# Altium schematic sheet PHOTODIODE.SchDoc
size 420 x 297 mm; SheetNumber: 5; SheetTotal: 5
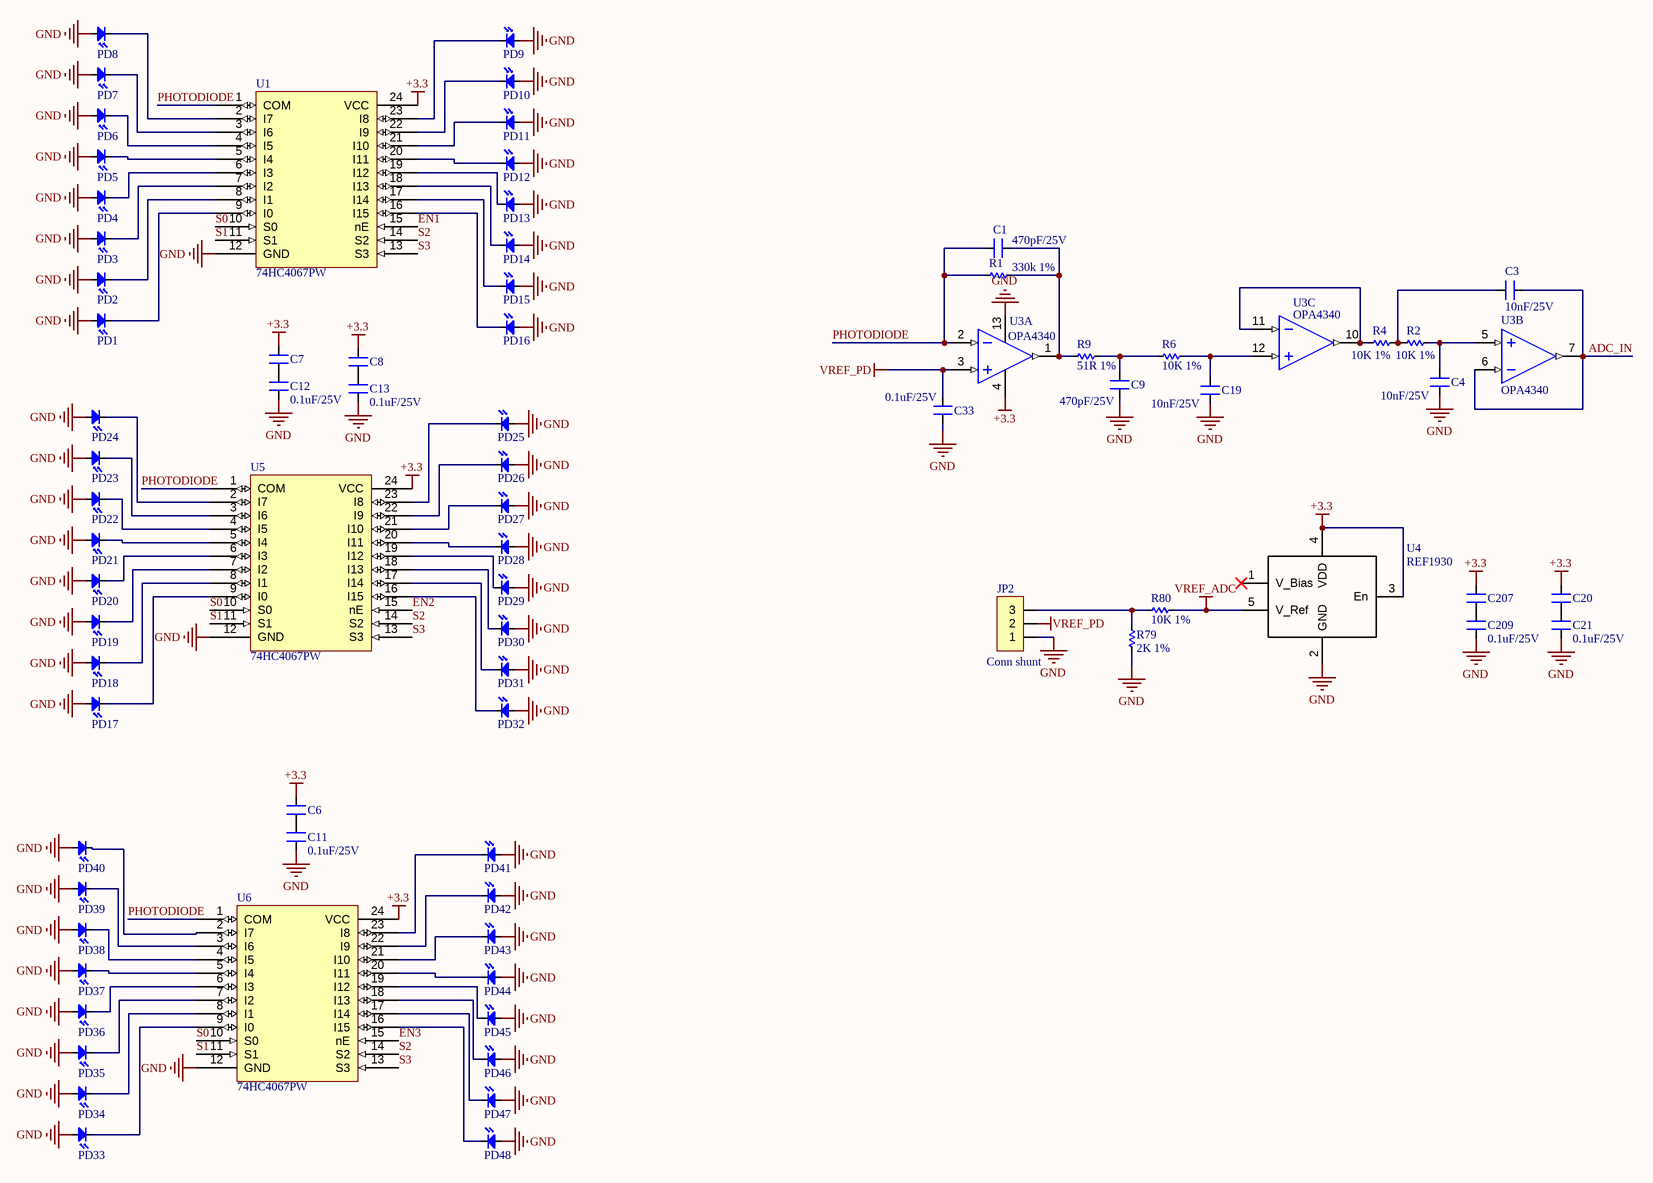
[diagram p0: PHOTODIODE.SchDoc]

## Parts
C1  470pF/25V  [SM-0603]
C3  10nF/25V  [SM-0603]
C4  10nF/25V  [SM-0603]
C6  0.1uF/25V  [SM-0603]  (value not drawn)
C7  0.1uF/25V  [SM-0603]  (value not drawn)
C8  0.1uF/25V  [SM-0603]  (value not drawn)
C9  470pF/25V  [SM-0603]
C11  0.1uF/25V  [SM-0603]
C12  0.1uF/25V  [SM-0603]
C13  0.1uF/25V  [SM-0603]
C19  10nF/25V  [SM-0603]
C20  0.1uF/25V  [SM-0603]  (value not drawn)
C21  0.1uF/25V  [SM-0603]
C33  0.1uF/25V  [SM-0603]
C207  0.1uF/25V  [SM-0603]  (value not drawn)
C209  0.1uF/25V  [SM-0603]
JP2  Conn shunt  [M50-3930342]
PD1  Photodiode  [VEMD5080X01]  (value not drawn)
PD2  Photodiode  [VEMD5080X01]  (value not drawn)
PD3  Photodiode  [VEMD5080X01]  (value not drawn)
PD4  Photodiode  [VEMD5080X01]  (value not drawn)
PD5  Photodiode  [VEMD5080X01]  (value not drawn)
PD6  Photodiode  [VEMD5080X01]  (value not drawn)
PD7  Photodiode  [VEMD5080X01]  (value not drawn)
PD8  Photodiode  [VEMD5080X01]  (value not drawn)
PD9  Photodiode  [VEMD5080X01]  (value not drawn)
PD10  Photodiode  [VEMD5080X01]  (value not drawn)
PD11  Photodiode  [VEMD5080X01]  (value not drawn)
PD12  Photodiode  [VEMD5080X01]  (value not drawn)
PD13  Photodiode  [VEMD5080X01]  (value not drawn)
PD14  Photodiode  [VEMD5080X01]  (value not drawn)
PD15  Photodiode  [VEMD5080X01]  (value not drawn)
PD16  Photodiode  [VEMD5080X01]  (value not drawn)
PD17  Photodiode  [VEMD5080X01]  (value not drawn)
PD18  Photodiode  [VEMD5080X01]  (value not drawn)
PD19  Photodiode  [VEMD5080X01]  (value not drawn)
PD20  Photodiode  [VEMD5080X01]  (value not drawn)
PD21  Photodiode  [VEMD5080X01]  (value not drawn)
PD22  Photodiode  [VEMD5080X01]  (value not drawn)
PD23  Photodiode  [VEMD5080X01]  (value not drawn)
PD24  Photodiode  [VEMD5080X01]  (value not drawn)
PD25  Photodiode  [VEMD5080X01]  (value not drawn)
PD26  Photodiode  [VEMD5080X01]  (value not drawn)
PD27  Photodiode  [VEMD5080X01]  (value not drawn)
PD28  Photodiode  [VEMD5080X01]  (value not drawn)
PD29  Photodiode  [VEMD5080X01]  (value not drawn)
PD30  Photodiode  [VEMD5080X01]  (value not drawn)
PD31  Photodiode  [VEMD5080X01]  (value not drawn)
PD32  Photodiode  [VEMD5080X01]  (value not drawn)
PD33  Photodiode  [VEMD5080X01]  (value not drawn)
PD34  Photodiode  [VEMD5080X01]  (value not drawn)
PD35  Photodiode  [VEMD5080X01]  (value not drawn)
PD36  Photodiode  [VEMD5080X01]  (value not drawn)
PD37  Photodiode  [VEMD5080X01]  (value not drawn)
PD38  Photodiode  [VEMD5080X01]  (value not drawn)
PD39  Photodiode  [VEMD5080X01]  (value not drawn)
PD40  Photodiode  [VEMD5080X01]  (value not drawn)
PD41  Photodiode  [VEMD5080X01]  (value not drawn)
PD42  Photodiode  [VEMD5080X01]  (value not drawn)
PD43  Photodiode  [VEMD5080X01]  (value not drawn)
PD44  Photodiode  [VEMD5080X01]  (value not drawn)
PD45  Photodiode  [VEMD5080X01]  (value not drawn)
PD46  Photodiode  [VEMD5080X01]  (value not drawn)
PD47  Photodiode  [VEMD5080X01]  (value not drawn)
PD48  Photodiode  [VEMD5080X01]  (value not drawn)
R1  330k 1%  [RES-SMD-0603]
R2  10K 1%  [RES-SMD-0603]
R4  10K 1%  [RES-SMD-0603]
R6  10K 1%  [RES-SMD-0603]
R9  51R 1%  [RES-SMD-0603]
R79  2K 1%  [RES-SMD-0603]
R80  10K 1%  [RES-SMD-0603]
U1  74HC4067PW  [TSSOP24]
U3  OPA4340  [SSOP16]  (parts A,B,C of 4)
U4  REF1930  [SOT23-5]
U5  74HC4067PW  [TSSOP24]
U6  74HC4067PW  [TSSOP24]

## Nets
+3.3: C6.2 C7.2 C8.2 C20.2 C207.2 U1.24(VCC) U3.4(+V) U4.3(En) U4.4(VDD) U5.24(VCC) U6.24(VCC)
GND: C4.1 C9.1 C11.1 C12.1 C13.1 C19.1 C21.1 C33.1 C209.1 JP2.1 PD1.1(A) PD2.1(A) PD3.1(A) PD4.1(A) PD5.1(A) PD6.1(A) PD7.1(A) PD8.1(A) PD9.1(A) PD10.1(A) PD11.1(A) PD12.1(A) PD13.1(A) PD14.1(A) PD15.1(A) PD16.1(A) PD17.1(A) PD18.1(A) PD19.1(A) PD20.1(A) PD21.1(A) PD22.1(A) PD23.1(A) PD24.1(A) PD25.1(A) PD26.1(A) PD27.1(A) PD28.1(A) PD29.1(A) PD30.1(A) PD31.1(A) PD32.1(A) PD33.1(A) PD34.1(A) PD35.1(A) PD36.1(A) PD37.1(A) PD38.1(A) PD39.1(A) PD40.1(A) PD41.1(A) PD42.1(A) PD43.1(A) PD44.1(A) PD45.1(A) PD46.1(A) PD47.1(A) PD48.1(A) R79.1 U1.12(GND) U3.13(-V) U4.2(GND) U5.12(GND) U6.12(GND)
VREF_ADC: R80.1 U4.5(V_Ref)
VREF_PD: C33.2 JP2.2 U3.3(IN+)
ADC_IN: C3.1 U3.6(IN-) U3.7(OUT)
EN1: U1.15(nE)
EN2: U5.15(nE)
EN3: U6.15(nE)
PHOTODIODE: C1.1 R1.1 U1.1(COM) U3.2(IN-) U5.1(COM) U6.1(COM)
S0: U1.10(S0) U5.10(S0) U6.10(S0)
S1: U1.11(S1) U5.11(S1) U6.11(S1)
S2: U1.14(S2) U5.14(S2) U6.14(S2)
S3: U1.13(S3) U5.13(S3) U6.13(S3)
NetC1_2: C1.2 R1.2 R9.1 U3.1(OUT)
NetC3_2: C3.2 R2.1 R4.2
NetC4_2: C4.2 R2.2 U3.5(IN+)
NetC6_1: C6.1 C11.2
NetC7_1: C7.1 C12.2
NetC8_1: C8.1 C13.2
NetC9_2: C9.2 R6.1 R9.2
NetC19_2: C19.2 R6.2 U3.12(IN+)
NetC20_1: C20.1 C21.2
NetC207_1: C207.1 C209.2
NetJP2_3: JP2.3 R79.2 R80.2
NetPD1_2: PD1.2(K) U1.9(I0)
NetPD2_2: PD2.2(K) U1.8(I1)
NetPD3_2: PD3.2(K) U1.7(I2)
NetPD4_2: PD4.2(K) U1.6(I3)
NetPD5_2: PD5.2(K) U1.5(I4)
NetPD6_2: PD6.2(K) U1.4(I5)
NetPD7_2: PD7.2(K) U1.3(I6)
NetPD8_2: PD8.2(K) U1.2(I7)
NetPD9_2: PD9.2(K) U1.23(I8)
NetPD10_2: PD10.2(K) U1.22(I9)
NetPD11_2: PD11.2(K) U1.21(I10)
NetPD12_2: PD12.2(K) U1.20(I11)
NetPD13_2: PD13.2(K) U1.19(I12)
NetPD14_2: PD14.2(K) U1.18(I13)
NetPD15_2: PD15.2(K) U1.17(I14)
NetPD16_2: PD16.2(K) U1.16(I15)
NetPD17_2: PD17.2(K) U5.9(I0)
NetPD18_2: PD18.2(K) U5.8(I1)
NetPD19_2: PD19.2(K) U5.7(I2)
NetPD20_2: PD20.2(K) U5.6(I3)
NetPD21_2: PD21.2(K) U5.5(I4)
NetPD22_2: PD22.2(K) U5.4(I5)
NetPD23_2: PD23.2(K) U5.3(I6)
NetPD24_2: PD24.2(K) U5.2(I7)
NetPD25_2: PD25.2(K) U5.23(I8)
NetPD26_2: PD26.2(K) U5.22(I9)
NetPD27_2: PD27.2(K) U5.21(I10)
NetPD28_2: PD28.2(K) U5.20(I11)
NetPD29_2: PD29.2(K) U5.19(I12)
NetPD30_2: PD30.2(K) U5.18(I13)
NetPD31_2: PD31.2(K) U5.17(I14)
NetPD32_2: PD32.2(K) U5.16(I15)
NetPD33_2: PD33.2(K) U6.9(I0)
NetPD34_2: PD34.2(K) U6.8(I1)
NetPD35_2: PD35.2(K) U6.7(I2)
NetPD36_2: PD36.2(K) U6.6(I3)
NetPD37_2: PD37.2(K) U6.5(I4)
NetPD38_2: PD38.2(K) U6.4(I5)
NetPD39_2: PD39.2(K) U6.3(I6)
NetPD40_2: PD40.2(K) U6.2(I7)
NetPD41_2: PD41.2(K) U6.23(I8)
NetPD42_2: PD42.2(K) U6.22(I9)
NetPD43_2: PD43.2(K) U6.21(I10)
NetPD44_2: PD44.2(K) U6.20(I11)
NetPD45_2: PD45.2(K) U6.19(I12)
NetPD46_2: PD46.2(K) U6.18(I13)
NetPD47_2: PD47.2(K) U6.17(I14)
NetPD48_2: PD48.2(K) U6.16(I15)
NetR4_1: R4.1 U3.10(OUT) U3.11(IN-)

Not connected (* = marked no-connect by the designer): U4 1(V_Bias)*

## Notes on the sheet
- Project:
- BEE-PC1
- Sub-system:
- Design by:
- Hung Nguyen D.
- Bao Bui Q.
- Sheet title:
- Sheet
- A3
- of
- Checked by:
- Approved by:
- Vu Pham
- Revision:
- Document No:
- V1.0.0
- Size:
- Date:

## Library data of the parts
C1 C3 C4 C6-C9 C11-C13 C19-C21 C33 C207 C209 = CM: 0603; Value: 103
JP2 = JP3: WR-PHD 2.54 mm Angled Socket Header; Manufacturer: W¨¹rth Elektronik eiSos GmbH; partNo: 613003143121; ComponentLink1 Description: Manufacturer; ComponentLink2 Description: Datasheet; NoPins: 03; Created Date: 29 March 2013; ComponentLink1URL: http://www.we-online.com; ComponentLink2URL: http://katalog.we-online.de/em/datasheet/6130xx143121.pdf; Created by: Karrer Zheng
R1 R2 R4 R6 R9 R79 R80 = Res-SMD: 0603; Manufacturer: Generic Components; Class: Passive; Published: 08/06/2000; Publisher: Altium Hobart Technology Centre
U1 U5 U6 = 74HC4067PW: TSSOP24
U3 = OPA4340: IC CMOS 4 CIRCUIT 16SSOP; Supplier 1: Mouser; Supplier Part Number 1: 595-OPA4340UA/2K5
U4 = REF19xx: REF1941AIDDCT